# Altium schematic sheet Microphone and LED STM32429.SchDoc
size A4; SPICEModelCacheBDXBXEUB: <root> / <DocumentId>BDXBXEUB</DocumentId> / <CacheFrame Number="0"> / <Model Name="cap" Kind="MDL"> / <Text>*Default semiconductor capacitor / .MODEL CAP C()</Text> / </Model> / <Model Name="led3" Kind="MDL"> / <Text>*Typ BLUE SiC LED: Vf=3.4V Vr=5V If=40mA trr=3uS / *LED Pinout: 1=A, 2=K / .MODEL LED3 D (IS=93.1P RS=42M N=7.47 BV=5 IBV=30U / + CJO=2.97P VJ=.75 M=.333 TT=4.32U)</Text> / </Model> / </CacheFrame> / </root>
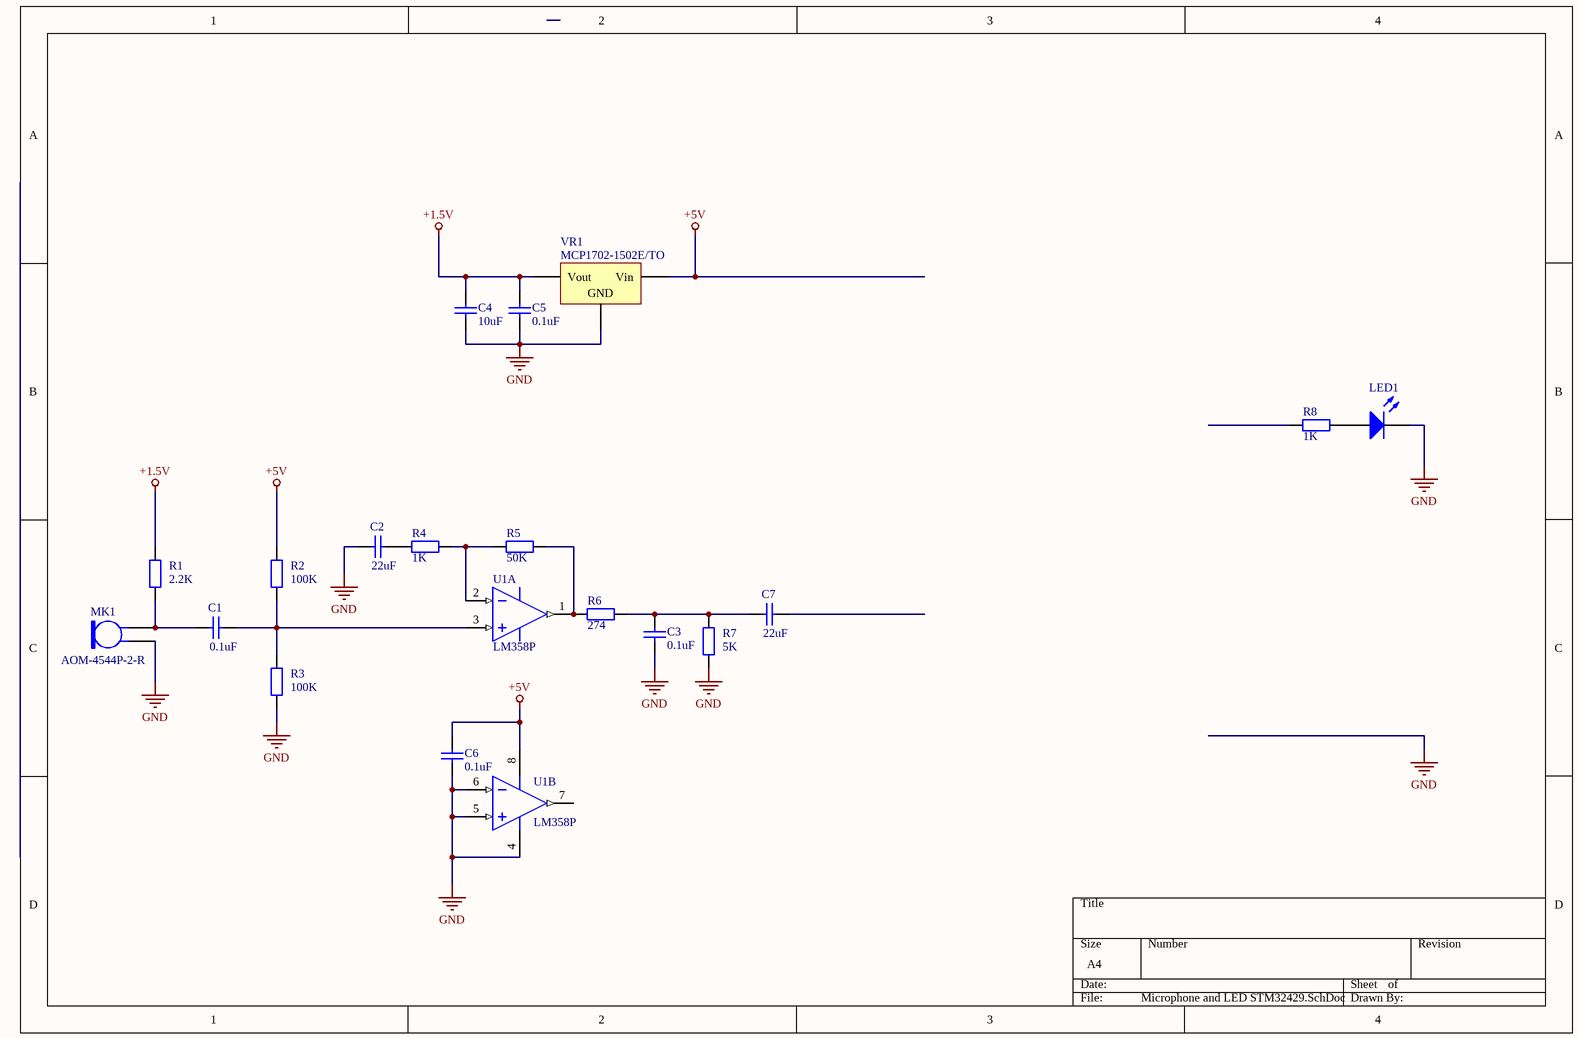
[diagram p0: Microphone and LED STM32429.SchDoc]

## Parts
C1  value 0.1uF  [RAD-0.3]  (hidden comment: Cap)
C2  value 22uF  [RAD-0.3]  (hidden comment: Cap)
C3  0.1uF  [RAD-0.3]
C4  10uF  [RAD-0.3]
C5  0.1uF  [RAD-0.3]
C6  0.1uF  [RAD-0.3]
C7  value 22uF  [RAD-0.3]  (hidden comment: Cap)
LED1  LED3  [3.5X2.8X1.9]  (value not drawn)
MK1  AOM-4544P-2-R  [PIN2]
R1  2.2K  [AXIAL-0.4]
R2  100K  [AXIAL-0.4]
R3  100K  [AXIAL-0.4]
R4  1K  [AXIAL-0.4]
R5  50K  [AXIAL-0.4]
R6  274  [AXIAL-0.4]
R7  5K  [AXIAL-0.4]
R8  1K  [AXIAL-0.4]
U1  LM358P  [P0008A]  (parts A,B of 2)
VR1  MCP1702-1502E/TO  [D2PAK_N]

## Nets
+1.5V: C4.2 C5.2 R1.2 VR1.1(Vout)
+5V: C6.1 R2.2 U1.8(VCC) VR1.3(Vin)
GND: C2.1 C3.1 C4.1 C5.1 C6.2 LED1.2(K) MK1.1 R3.1 R7.1 U1.4(GND) U1.5(2IN+) U1.6(2IN-) VR1.2(GND)
NetC1_1: C1.1 MK1.2 R1.1
NetC1_2: C1.2 R2.1 R3.2 U1.3(1IN+)
NetC2_2: C2.2 R4.1
NetC3_2: C3.2 C7.1 R6.2 R7.2
NetLED1_1: LED1.1(A) R8.2
NetR4_2: R4.2 R5.1 U1.2(1IN-)
NetR5_2: R5.2 R6.1 U1.1(1OUT)

Not connected (* = marked no-connect by the designer): C7 2; R8 1; U1 7(2OUT)

## Library data of the parts
C1 C2 C4 C5 C7 = Cap: Capacitor; Published: 8-Jun-2000; LatestRevisionDate: 17-Jul-2002; LatestRevisionNote: Re-released for DXP Platform.; PackageReference: RAD-0.3; Publisher: Altium Limited; PackageDescription: Radial Cap, Thru-Hole; 2 Leads; 0.3 in Pin Spacing
C3 C6 = Cap: Capacitor; Value: 100pF; Published: 8-Jun-2000; LatestRevisionDate: 17-Jul-2002; LatestRevisionNote: Re-released for DXP Platform.; PackageReference: RAD-0.3; Publisher: Altium Limited; PackageDescription: Radial Cap, Thru-Hole; 2 Leads; 0.3 in Pin Spacing
LED1 = LED3: Typical BLUE SiC LED; Published: 8-Jun-2000; LatestRevisionDate: 17-Dec-2003; LatestRevisionNote: PCB Footprint replaced.; DatasheetVersion: 16-Apr-2002; PackageVersion: 16-Apr-2002; PackageReference: 3.5X2.8X1.9; Publisher: Altium Limited; PackageDescription: SM LED; 2 C-Bend Leads; Body 3.5 x 2.8 x 1.9 mm, inc leads (LxWxH typ)
MK1 = Mic2: Microphone; Published: 24-Mar-1999; LatestRevisionDate: 17-Jul-2002; LatestRevisionNote: Re-released for DXP Platform.; PackageReference: PIN2; Publisher: Altium Limited
R1 R2 R7 = Res2: Resistor; Value: 1K; Published: 8-Jun-2000; LatestRevisionDate: 17-Jul-2002; LatestRevisionNote: Re-released for DXP Platform.; PackageReference: AXIAL-0.4; Publisher: Altium Limited; PackageDescription: Axial Device, Thru-Hole; 2 Leads; 0.4 in Pin Spacing
R3-R6 R8 = Res2: Resistor; Published: 8-Jun-2000; LatestRevisionDate: 17-Jul-2002; LatestRevisionNote: Re-released for DXP Platform.; PackageReference: AXIAL-0.4; Publisher: Altium Limited; PackageDescription: Axial Device, Thru-Hole; 2 Leads; 0.4 in Pin Spacing
  R3: Value: 100K
U1 = CMP-2000-06549-1: Dual Operational Amplifier, 3 to 32 V, 0 to 70 degC, 8-Pin PDIP (P), RoHS, Tape and Reel; Manufacturer: Technik Industrial; Datasheet Version: Rev. T, 04/2015; Datasheet URL: http://www.ti.com/lit/ds/symlink/lm358.pdf; Manufacturer URL: http://www.technik.com.hk/; Package Description: 8-Pin Double In-line Package, Body 9.59 x 6.35 mm, Pitch 2.54 mm; Mounting Technology: ThroughHole; Package URL: http://www.ti.com/lit/ml/mpdi001b/mpdi001b.pdf; Package Reference: P8
VR1 = Volt Reg: Voltage Regulator; Published: 24-Mar-1999; LatestRevisionDate: 29-May-2009; LatestRevisionNote: IPC-7351 Footprint Added.; PackageReference: D2PAK; Publisher: Altium Limited; PackageDescription: 3-Pin Transistor Outline Package 2.54 mm Pitch, 15.1 mm Lead Span